# EAGLE schematic FiddleYard_Mip50_Station (EAGLE 6.6.0)

## Sheet 1 of 2
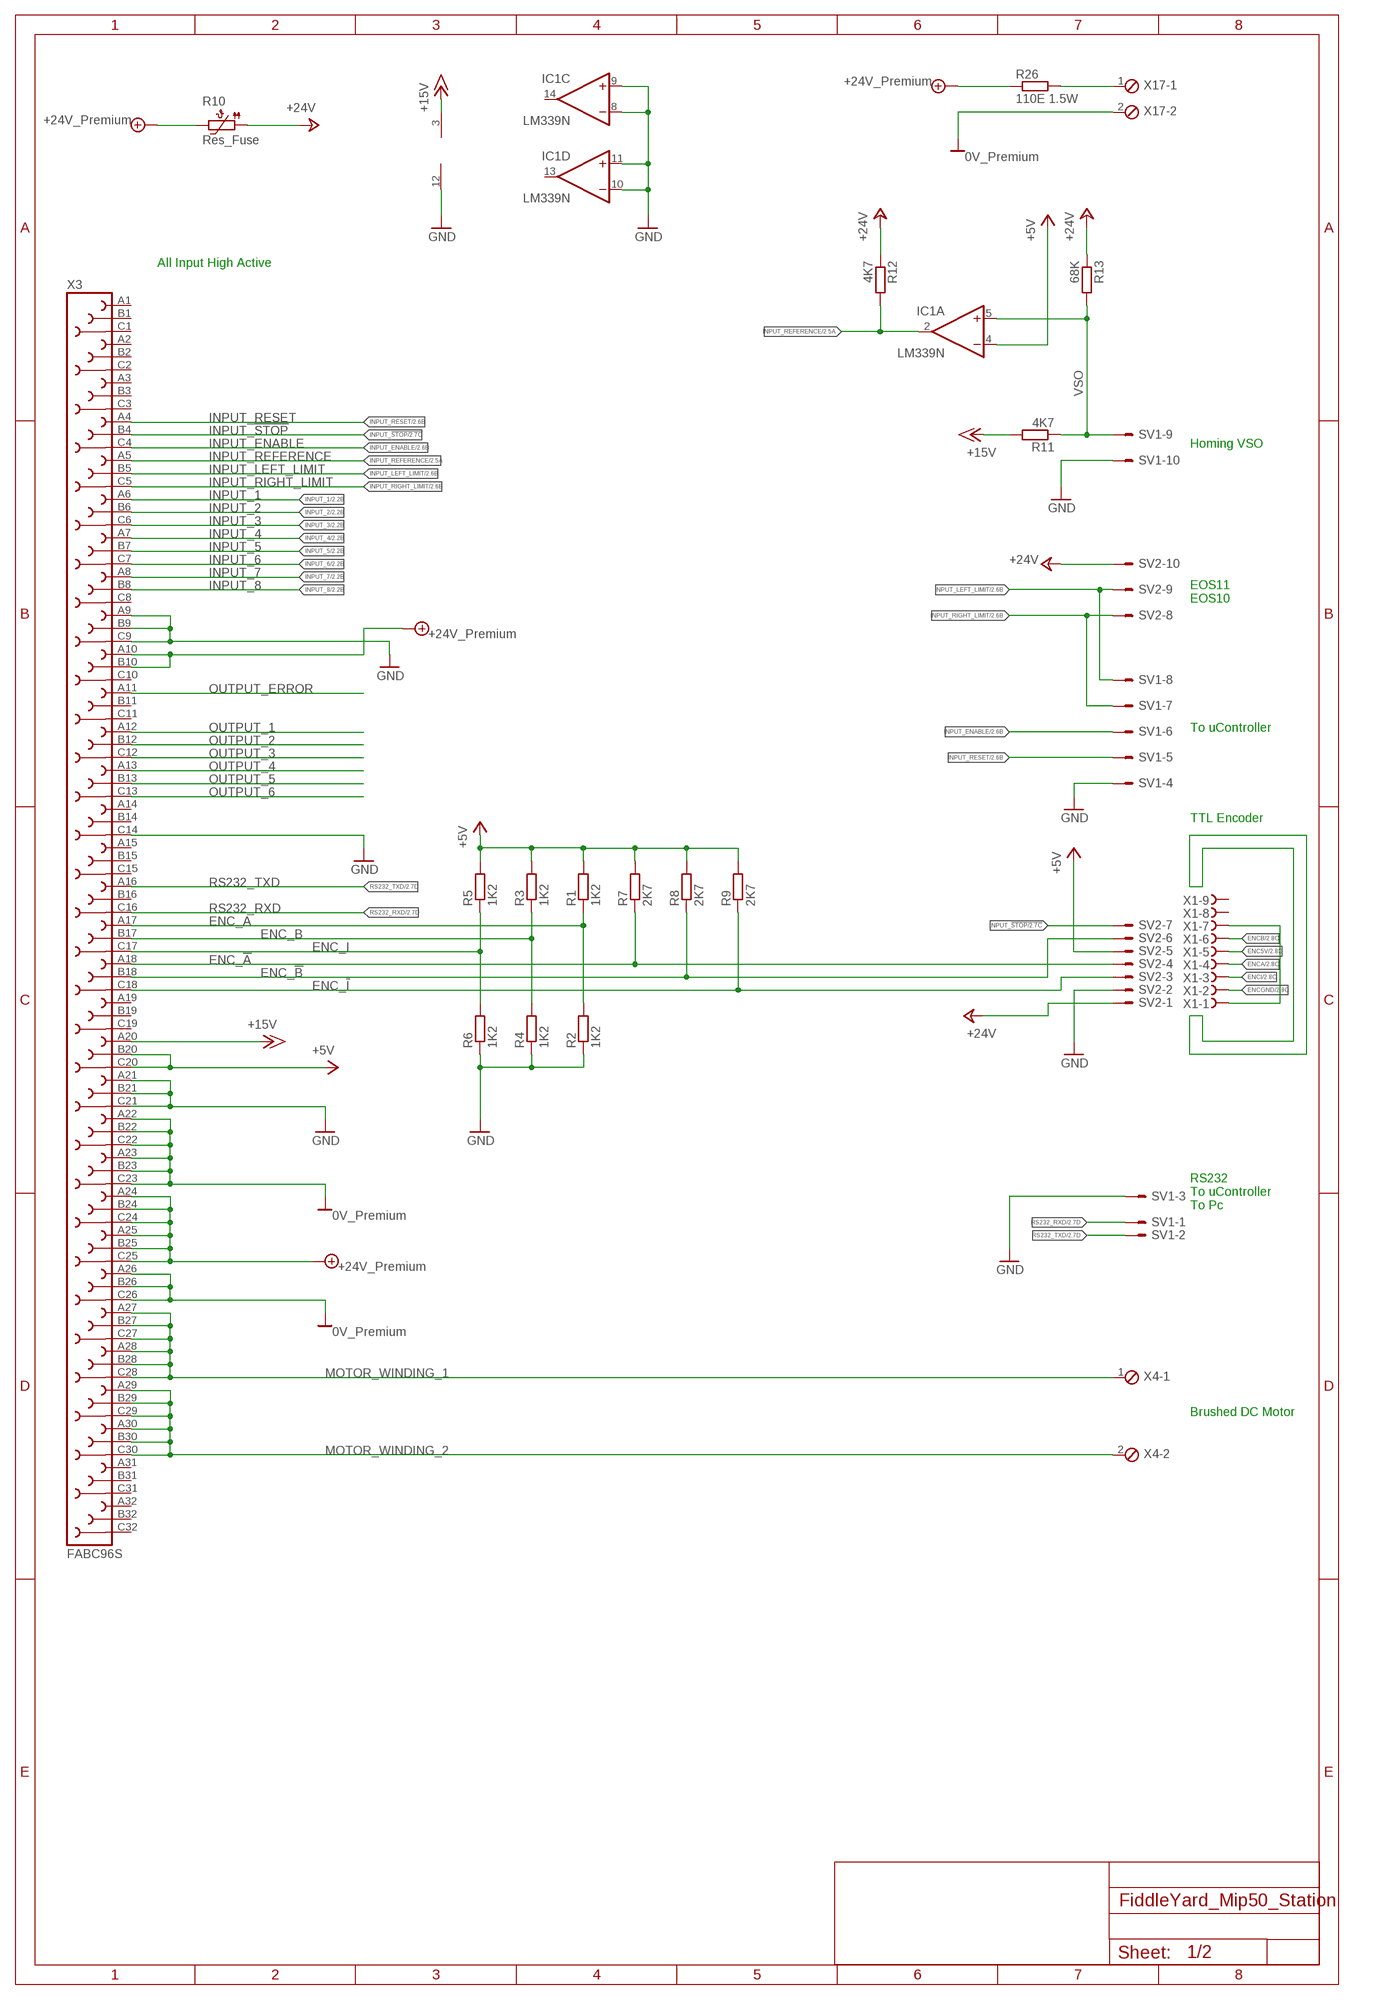
[diagram p0: schematic, sheet 1]

### Parts
IC1  LM339N  [DIL14]
R1  1K2  R-EU_0204/2V  [0204V]
R2  1K2  R-EU_0204/2V  [0204V]
R3  1K2  R-EU_0204/2V  [0204V]
R4  1K2  R-EU_0204/2V  [0204V]
R5  1K2  R-EU_0204/2V  [0204V]
R6  1K2  R-EU_0204/2V  [0204V]
R7  2K7  R-EU_0204/2V  [0204V]
R8  2K7  R-EU_0204/2V  [0204V]
R9  2K7  R-EU_0204/2V  [0204V]
R10  Res_Fuse  PTC-SOD70  [SOD70]
R11  4K7  R-EU_0204/2V  [0204V]
R12  4K7  R-EU_0204/2V  [0204V]
R13  68K  R-EU_0204/2V  [0204V]
R26  110E 1.5W  R-EU_0204/2V  [0204V]
SV1  ML10E  [ML10]
SV2  ML10E  [ML10]
X1  F09VS  [F09V]
X3  FABC96S  [FABC96S]
X4  MPT2  [2POL254]
X17  MPT2  [2POL254]

### Nets
0V: X3.A22 X3.A23 X3.A26 X3.B22 X3.B23 X3.B26 X3.C22 X3.C23 X3.C26 X17.2 ; supply symbol labelled 0V_Premium ; also sheet 2
+5V: IC1.4(A:-IN) R1.2 R3.2 R5.2 R7.2 R8.2 R9.2 SV2.5 ; also sheet 2
+15V: IC1.3(P:V+) R11.2 X3.A20 ; also sheet 2
+24V: R10.1 R10.2 R12.1 R13.1 R26.1 SV2.1 SV2.10 X3.A10 X3.A24 X3.A25 X3.B10 X3.B24 X3.B25 X3.C24 X3.C25 ; supply symbol labelled +24V_Premium ; also sheet 2
ENC5V: X1.5 ; also sheet 2
ENC_!A: R7.1 SV2.4 X3.A18 ; also sheet 2
ENC_!B: R8.1 SV2.6 X3.B18 ; also sheet 2
ENC_!I: R9.1 SV2.3 X3.C18 ; also sheet 2
ENC_+5V: X3.B20 X3.C20 ; supply symbol labelled +5V ; also sheet 2
ENC_A: R1.1 R2.2 X3.A17 ; also sheet 2
ENC_B: R3.1 R4.2 X3.B17 ; also sheet 2
ENC_I: R5.1 R6.2 X3.C17 ; also sheet 2
ENCA: X1.4 ; also sheet 2
ENCB: X1.6 ; also sheet 2
ENCGND: X1.2 ; also sheet 2
ENCI: X1.3 ; also sheet 2
GND: IC1.8(C:-IN) IC1.9(C:+IN) IC1.10(D:-IN) IC1.11(D:+IN) IC1.12(P:GND) R2.1 R4.1 R6.1 SV1.3 SV1.4 SV1.10 SV2.2 X3.A9 X3.A21 X3.B9 X3.B21 X3.C9 X3.C14 X3.C21 ; also sheet 2
INPUT_1: X3.A6 ; also sheet 2
INPUT_2: X3.B6 ; also sheet 2
INPUT_3: X3.C6 ; also sheet 2
INPUT_4: X3.A7 ; also sheet 2
INPUT_5: X3.B7 ; also sheet 2
INPUT_6: X3.C7 ; also sheet 2
INPUT_7: X3.A8 ; also sheet 2
INPUT_8: X3.B8 ; also sheet 2
INPUT_!STOP: SV2.7 X3.B4 ; also sheet 2
INPUT_ENABLE: SV1.6 X3.C4 ; also sheet 2
INPUT_LEFT_LIMIT: SV1.8 SV2.9 X3.B5 ; also sheet 2
INPUT_REFERENCE: IC1.2(A:OUT) R12.2 X3.A5 ; also sheet 2
INPUT_RESET: SV1.5 X3.A4 ; also sheet 2
INPUT_RIGHT_LIMIT: SV1.7 SV2.8 X3.C5 ; also sheet 2
MOTOR_WINDING_1: X3.A27 X3.A28 X3.B27 X3.B28 X3.C27 X3.C28 X4.1 ; also sheet 2
MOTOR_WINDING_2: X3.A29 X3.A30 X3.B29 X3.B30 X3.C29 X3.C30 X4.2 ; also sheet 2
N$3: X1.1 X1.7
N$5: R26.2 X17.1
OUTPUT_1: X3.A12 ; also sheet 2
OUTPUT_2: X3.B12 ; also sheet 2
OUTPUT_3: X3.C12 ; also sheet 2
OUTPUT_4: X3.A13 ; also sheet 2
OUTPUT_5: X3.B13 ; also sheet 2
OUTPUT_6: X3.C13 ; also sheet 2
OUTPUT_ERROR: X3.A11 ; also sheet 2
RS232_RXD: SV1.1 X3.C16 ; also sheet 2
RS232_TXD: SV1.2 X3.A16 ; also sheet 2
VSO: IC1.5(A:+IN) R11.1 R13.2 SV1.9 ; also sheet 2
Unconnected: IC1.13(D:OUT) IC1.14(C:OUT) X1.8 X1.9 X3.A1 X3.A2 X3.A3 X3.A14 X3.A15 X3.A19 X3.A31 X3.A32 X3.B1 X3.B2 X3.B3 X3.B11 X3.B14 X3.B15 X3.B16 X3.B19 X3.B31 X3.B32 X3.C1 X3.C2 X3.C3 X3.C8 X3.C10 X3.C11 X3.C15 X3.C19 X3.C31 X3.C32

### Notes on the sheet
- All Input High Active
- Homing VSO
- EOS11
  EOS10
- To uController
- TTL Encoder
- RS232
  To uController
  To Pc
- Brushed DC Motor

## Sheet 2 of 2
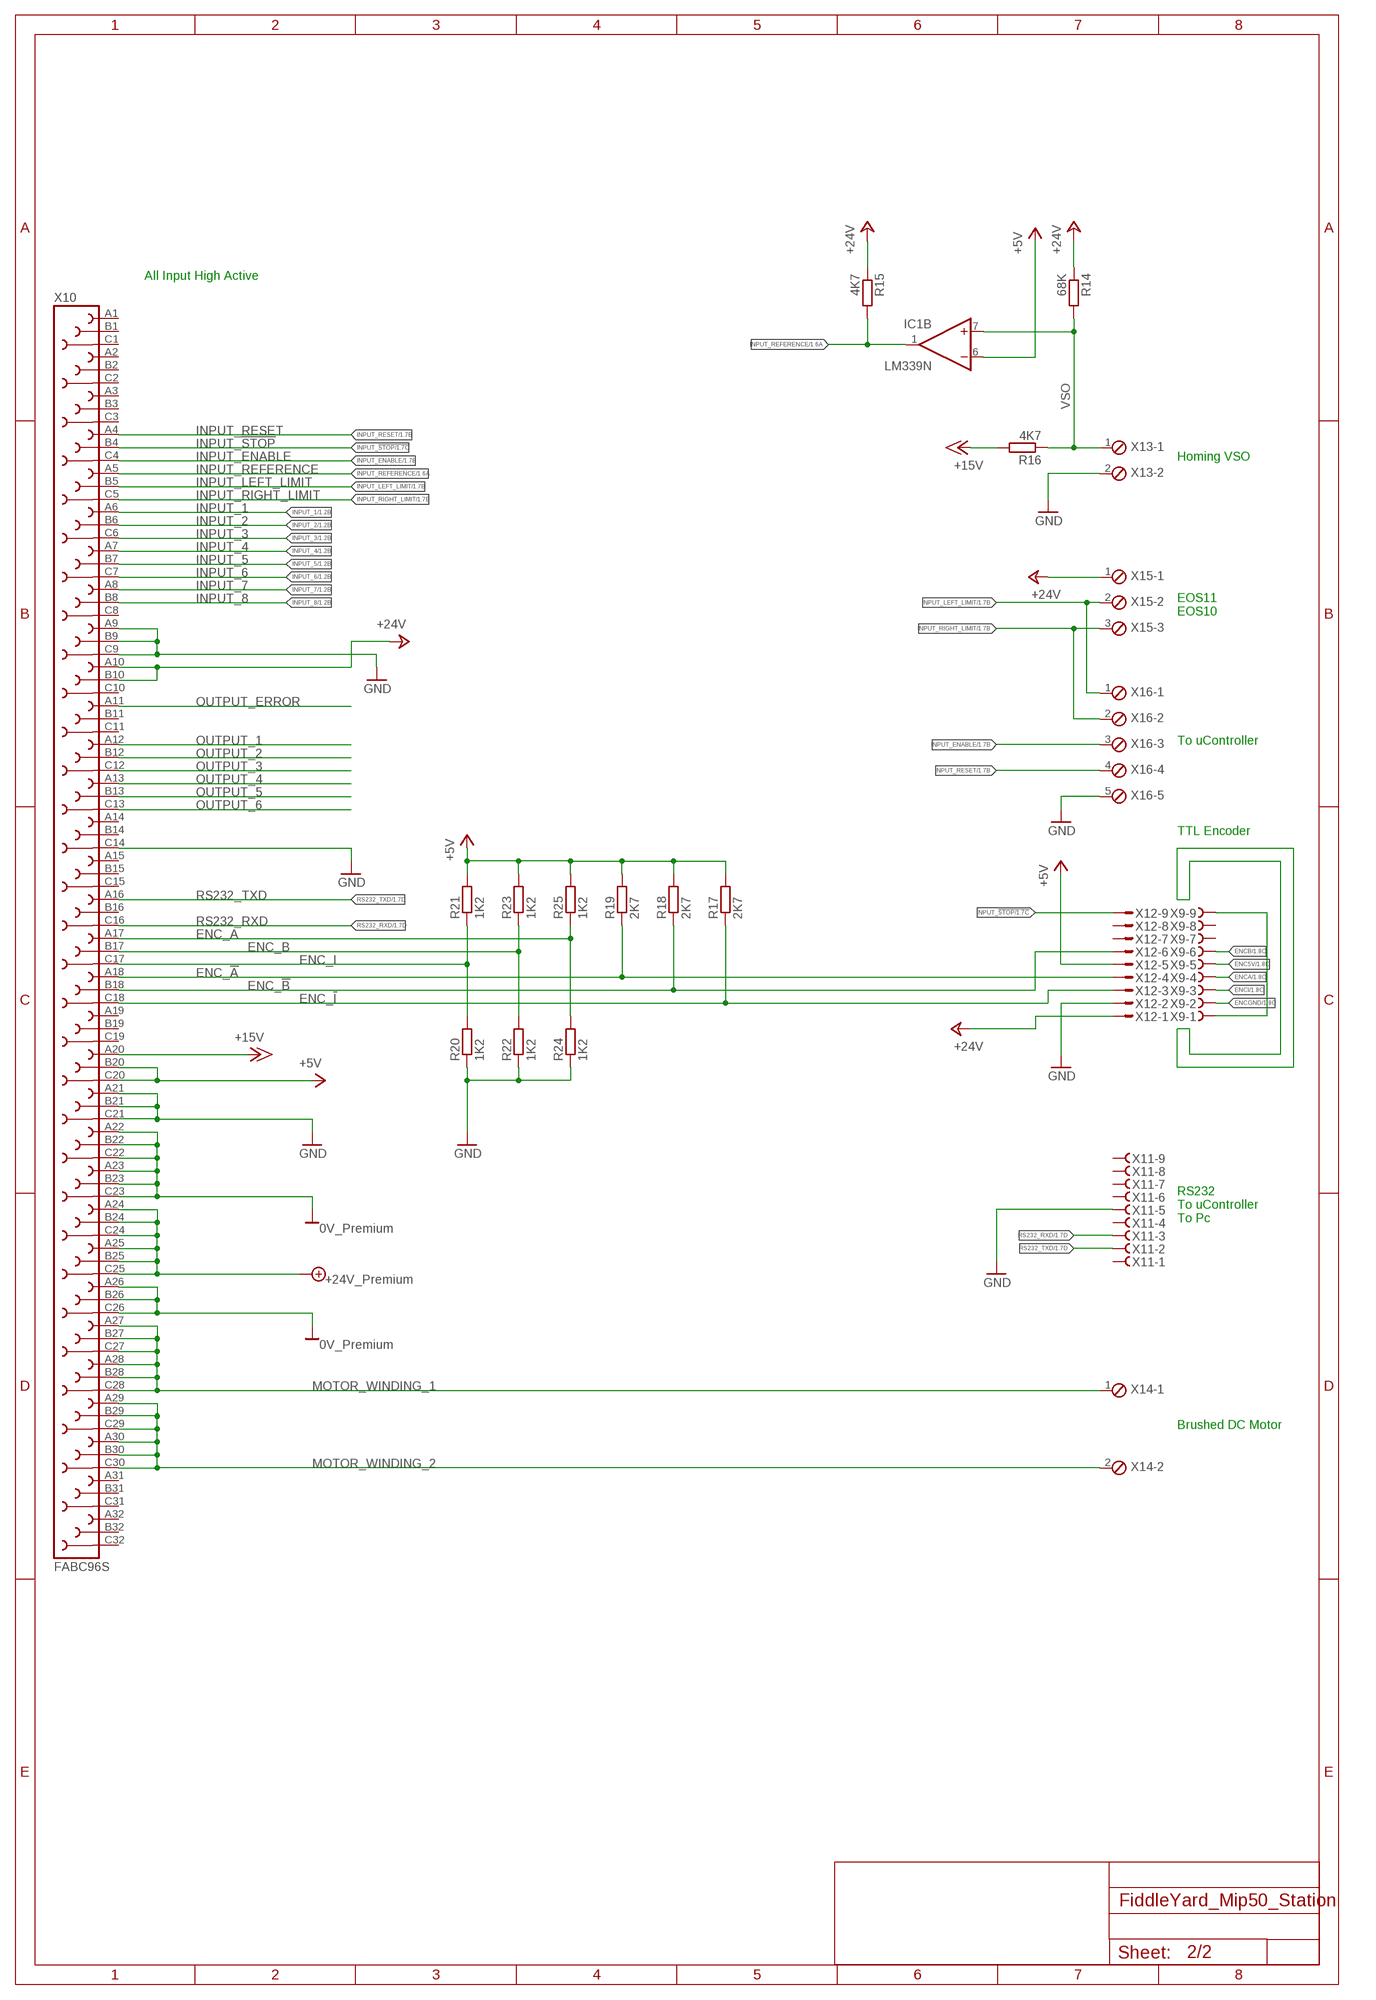
[diagram p1: schematic, sheet 2]

### Parts
R14  68K  R-EU_0204/2V  [0204V]
R15  4K7  R-EU_0204/2V  [0204V]
R16  4K7  R-EU_0204/2V  [0204V]
R17  2K7  R-EU_0204/2V  [0204V]
R18  2K7  R-EU_0204/2V  [0204V]
R19  2K7  R-EU_0204/2V  [0204V]
R20  1K2  R-EU_0204/2V  [0204V]
R21  1K2  R-EU_0204/2V  [0204V]
R22  1K2  R-EU_0204/2V  [0204V]
R23  1K2  R-EU_0204/2V  [0204V]
R24  1K2  R-EU_0204/2V  [0204V]
R25  1K2  R-EU_0204/2V  [0204V]
X9  F09VS  [F09V]
X10  FABC96S  [FABC96S]
X11  F09VS  [F09V]
X12  M09VBS  [M09VB]
X13  MPT2  [2POL254]
X14  MPT2  [2POL254]
X15  MPT3  [3POL254]
X16  MPT5  [5POL254]

### Nets
0V: X10.A22 X10.A23 X10.A26 X10.B22 X10.B23 X10.B26 X10.C22 X10.C23 X10.C26 ; supply symbol labelled 0V_Premium ; also sheet 1
+5V: R17.2 R18.2 R19.2 R21.2 R23.2 R25.2 X12.5 ; also sheet 1
+15V: R16.2 X10.A20 ; also sheet 1
+24V: R14.1 R15.1 X10.A10 X10.A24 X10.A25 X10.B10 X10.B24 X10.B25 X10.C24 X10.C25 X12.1 X15.1 ; supply symbol labelled +24V_Premium ; also sheet 1
ENC5V: X9.5 ; also sheet 1
ENC_!A: R19.1 X10.A18 X12.4 ; also sheet 1
ENC_!B: R18.1 X10.B18 X12.6 ; also sheet 1
ENC_!I: R17.1 X10.C18 X12.3 ; also sheet 1
ENC_+5V: X10.B20 X10.C20 ; supply symbol labelled +5V ; also sheet 1
ENC_A: R24.2 R25.1 X10.A17 ; also sheet 1
ENC_B: R22.2 R23.1 X10.B17 ; also sheet 1
ENC_I: R20.2 R21.1 X10.C17 ; also sheet 1
ENCA: X9.4 ; also sheet 1
ENCB: X9.6 ; also sheet 1
ENCGND: X9.2 ; also sheet 1
ENCI: X9.3 ; also sheet 1
GND: R20.1 R22.1 R24.1 X10.A9 X10.A21 X10.B9 X10.B21 X10.C9 X10.C14 X10.C21 X11.5 X12.2 X13.2 X16.5 ; also sheet 1
INPUT_1: X10.A6 ; also sheet 1
INPUT_2: X10.B6 ; also sheet 1
INPUT_3: X10.C6 ; also sheet 1
INPUT_4: X10.A7 ; also sheet 1
INPUT_5: X10.B7 ; also sheet 1
INPUT_6: X10.C7 ; also sheet 1
INPUT_7: X10.A8 ; also sheet 1
INPUT_8: X10.B8 ; also sheet 1
INPUT_!STOP: X10.B4 X12.9 ; also sheet 1
INPUT_ENABLE: X10.C4 X16.3 ; also sheet 1
INPUT_LEFT_LIMIT: X10.B5 X15.2 X16.1 ; also sheet 1
INPUT_REFERENCE: R15.2 X10.A5 ; also sheet 1
INPUT_RESET: X10.A4 X16.4 ; also sheet 1
INPUT_RIGHT_LIMIT: X10.C5 X15.3 X16.2 ; also sheet 1
MOTOR_WINDING_1: X10.A27 X10.A28 X10.B27 X10.B28 X10.C27 X10.C28 X14.1 ; also sheet 1
MOTOR_WINDING_2: X10.A29 X10.A30 X10.B29 X10.B30 X10.C29 X10.C30 X14.2 ; also sheet 1
N$4: X9.1 X9.9
OUTPUT_1: X10.A12 ; also sheet 1
OUTPUT_2: X10.B12 ; also sheet 1
OUTPUT_3: X10.C12 ; also sheet 1
OUTPUT_4: X10.A13 ; also sheet 1
OUTPUT_5: X10.B13 ; also sheet 1
OUTPUT_6: X10.C13 ; also sheet 1
OUTPUT_ERROR: X10.A11 ; also sheet 1
RS232_RXD: X10.C16 X11.3 ; also sheet 1
RS232_TXD: X10.A16 X11.2 ; also sheet 1
VSO: R14.2 R16.1 X13.1 ; also sheet 1
Unconnected: IC1.1(B:OUT) IC1.6(B:-IN) IC1.7(B:+IN) X9.7 X9.8 X10.A1 X10.A2 X10.A3 X10.A14 X10.A15 X10.A19 X10.A31 X10.A32 X10.B1 X10.B2 X10.B3 X10.B11 X10.B14 X10.B15 X10.B16 X10.B19 X10.B31 X10.B32 X10.C1 X10.C2 X10.C3 X10.C8 X10.C10 X10.C11 X10.C15 X10.C19 X10.C31 X10.C32 X11.1 X11.4 X11.6 X11.7 X11.8 X11.9 X12.7 X12.8

### Notes on the sheet
- All Input High Active
- Homing VSO
- EOS11
  EOS10
- To uController
- TTL Encoder
- RS232
  To uController
  To Pc
- Brushed DC Motor

## Library data of the parts
IC1 = linear:LM339: Low Power Low Offset Voltage Quad Comparators with open collector; LM139/LM239/LM339/LM2901/LM3302
R1-R9 R11-R26 = rcl:R-EU_: RESISTOR, European symbol
R10 = ptc-ntc:PTC-: Positive Temperature Coefficient Resistor (PTC) termistor Philips KTY81-210 - KTY81-252 Source: 153627-da-01-en-Temperatur-Sensor_KTY10-6_Philips.pdf; OC_FARNELL: unknown; OC_NEWARK: unknown
SV1 SV2 = con-harting-ml:ML10?E: HARTING; OC_FARNELL: unknown; OC_NEWARK: unknown
X1 X9 X11 = con-subd:F09?S: SUB-D; OC_FARNELL: unknown; OC_NEWARK: unknown
X3 X10 = con-vg:FABC96S: CONNECTOR female, 96 pins, block, type C, rows ABC, grid 2.54 mm
X4 X13 X14 X17 = con-phoenix-254:MPT2: PHOENIX CONNECTOR; OC_FARNELL: unknown; OC_NEWARK: unknown
X12 = con-subd:M09?S: SUB-D; OC_FARNELL: unknown; OC_NEWARK: unknown
X15 = con-phoenix-254:MPT3: PHOENIX CONNECTOR; OC_FARNELL: unknown; OC_NEWARK: unknown
X16 = con-phoenix-254:MPT5: PHOENIX CONNECTOR; OC_FARNELL: unknown; OC_NEWARK: unknown